# Altium schematic sheet croc_sch.SchDoc: =mytitle
size Letter; Organization: ISN Lab Bioengineering Dept.; Address1: UCSD m/c 0412 PFBH Rm302; Address2: 9500 Gilman Drive; Address3: La Jolla, CA 92092; Website: http://isn.ucsd.edu; SheetNumber: 1; SheetTotal: 1; Size: Letter
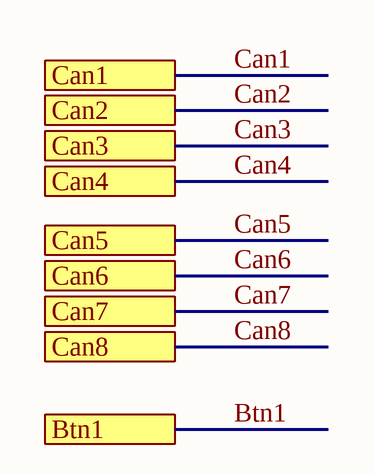
[diagram p0: croc_sch.SchDoc]

## Ports
Btn1, Can1, Can2, Can3, Can4, Can5, Can6, Can7, Can8

## Nets
Btn1: port Btn1
Can1: port Can1
Can2: port Can2
Can3: port Can3
Can4: port Can4
Can5: port Can5
Can6: port Can6
Can7: port Can7
Can8: port Can8

## Notes on the sheet
- Size:
- Title
- Date:
- Number:
- Revision:
- Time:
- Author:
- Sheet
- of
- File: